# Altium project EMDO601_Patch.PrjPcb
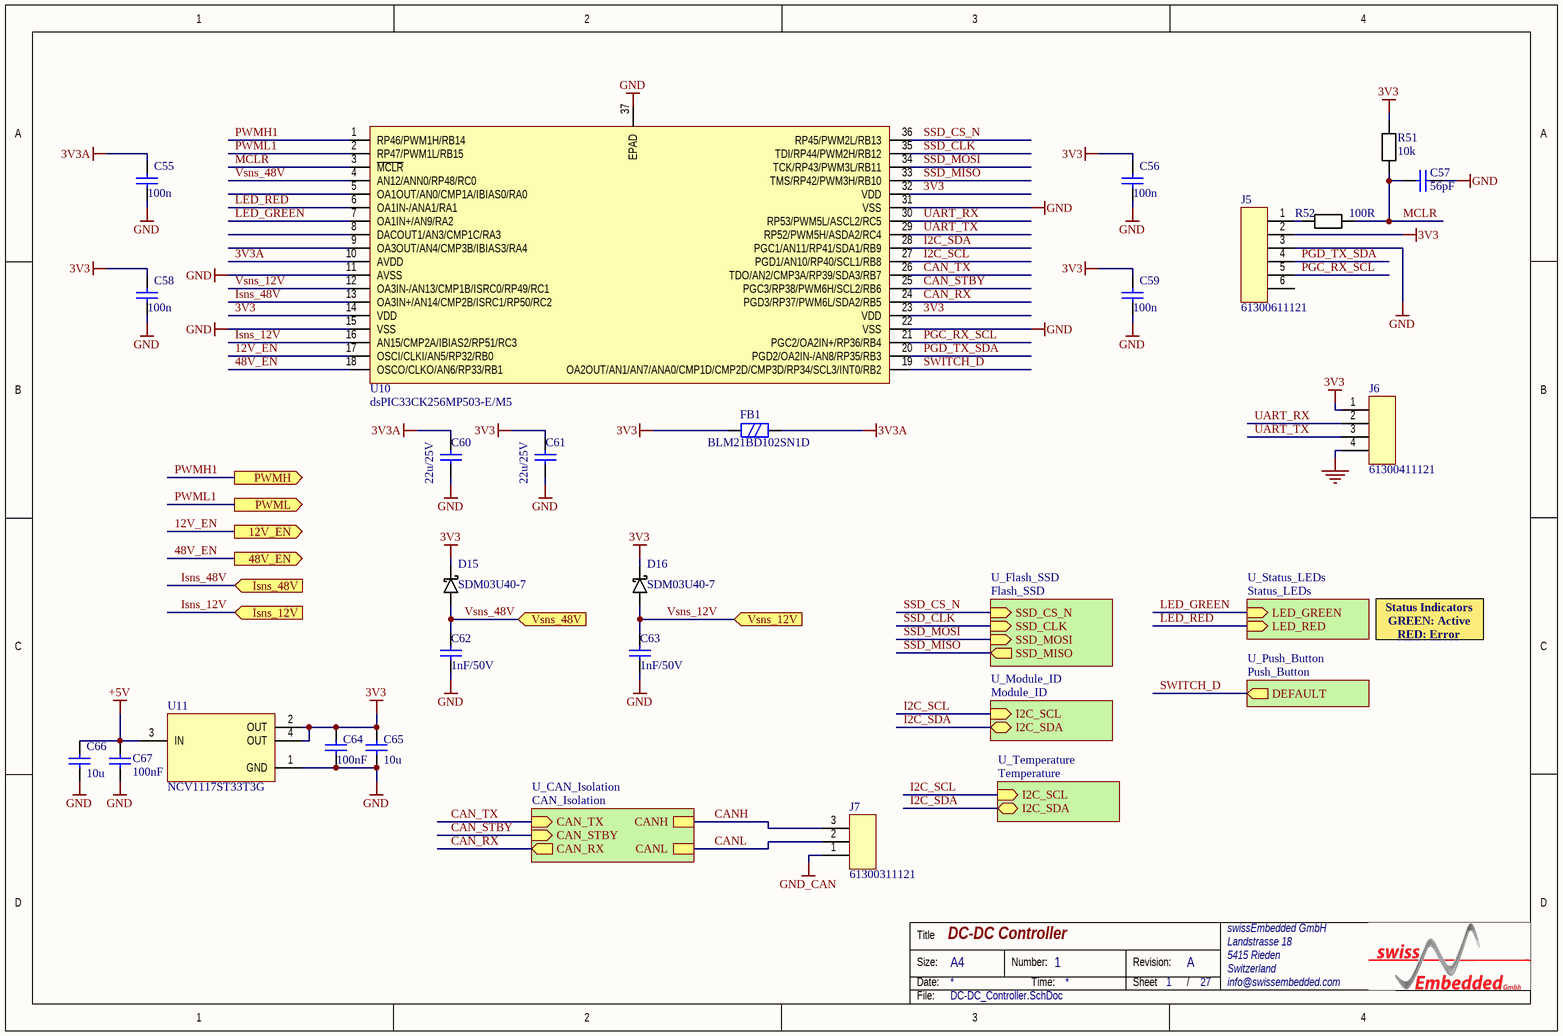
[diagram p0: DC-DC_Controller.SchDoc]
2 sheets, 182 parts. Net scope: hierarchical (ports join the sheet entries above them; power ports are global).
Board file: EMDO601_Patch.PcbDoc
Sheets:
  DC-DC_Controller.SchDoc
  DC-DC_Converter.SchDoc

## Sheet DC-DC_Controller.SchDoc: DC-DC Controller
size A4; CompanyName: swissEmbedded GmbH; Organization: swissEmbedded GmbH; Address1: Landstrasse 18; Address2: 5415 Rieden; Address3: Switzerland; Address4: info@swissembedded.com; DocumentNumber: 1; Revision: A; SheetNumber: 1; SheetTotal: 27

### Parts
C55  100n  [C0603]
C56  100n  [C0603]
C57  56pF  [C0603]
C58  100n  [C0603]
C59  100n  [C0603]
C60  22u/25V  [C0805]
C61  22u/25V  [C0805]
C62  1nF/50V  [C0603]
C63  1nF/50V  [C0603]
C64  100nF  [C0603]
C65  10u  [C1206]
C66  10u  [C1206]
C67  100nF  [C0603]
D15  SDM03U40-7  [SOD523]
D16  SDM03U40-7  [SOD523]
FB1  BLM21BD102SN1D  [R0805]
J5  61300611121  [Header-2.54m-6pin]
J6  61300411121  [Header-2.54m-4pin]
J7  61300311121  [Header-2.54m-3pin]
R51  10k  [R0603]
R52  100R  [R0603]
U10  dsPIC33CK256MP503-E/M5  [UQFN-36]
U11  NCV1117ST33T3G  [SOT223-3]

### Sub-sheets
U_CAN_Isolation = CAN_Isolation (file not in this document): CAN_TX (in), CAN_RX (out), CAN_STBY (in), CANH, CANL
U_Flash_SSD = Flash_SSD (file not in this document): SSD_CS_N (in), SSD_CLK (in), SSD_MOSI (in), SSD_MISO (out)
U_Module_ID = Module_ID (file not in this document): I2C_SCL (in), I2C_SDA (bidir)
U_Push_Button = Push_Button (file not in this document): DEFAULT (out)
U_Status_LEDs = Status_LEDs (file not in this document): LED_RED (in), LED_GREEN (in)
U_Temperature = Temperature (file not in this document): I2C_SCL (in), I2C_SDA (bidir)

### Ports
12V_EN (out), 48V_EN (out), Isns_12V (in), Isns_48V (in), PWMH (out), PWML (out), Vsns_12V (in), Vsns_48V (in)

### Nets
3V3: C56.2 C58.2 C59.2 C61.2 C64.2 C65.2 D15.C D16.C FB1.2 J5.2 J6.1 R51.1 U10.14(VDD) U10.23(VDD) U10.32(VDD) U11.2(OUT) U11.4(OUT)
3V3A: C55.2 C60.2 FB1.1 U10.10(AVDD)
+5V: C66.2 C67.2 U11.3(IN)
GND: C55.1 C56.1 C57.2 C58.1 C59.1 C60.1 C61.1 C62.1 C63.1 C64.1 C65.1 C66.1 C67.1 J5.3 J6.4 U10.11(AVSS) U10.15(VSS) U10.22(VSS) U10.31(VSS) U10.37(EPAD) U11.1(GND)
GND_CAN: J7.1
12V_EN: U10.17(OSCI/CLKI/AN5/RP32/RB0) ; port 12V_EN
48V_EN: U10.18(OSCO/CLKO/AN6/RP33/RB1) ; port 48V_EN
CAN_RX: U10.24(PGD3/RP37/PWM6L/SDA2/RB5) ; sheet U_CAN_Isolation/CAN_RX
CAN_STBY: U10.25(PGC3/RP38/PWM6H/SCL2/RB6) ; sheet U_CAN_Isolation/CAN_STBY
CAN_TX: U10.26(TDO/AN2/CMP3A/RP39/SDA3/RB7) ; sheet U_CAN_Isolation/CAN_TX
CANH: J7.3 ; sheet U_CAN_Isolation/CANH
CANL: J7.2 ; sheet U_CAN_Isolation/CANL
I2C_SCL: U10.27(PGD1/AN10/RP40/SCL1/RB8) ; sheet U_Module_ID/I2C_SCL, sheet U_Temperature/I2C_SCL
I2C_SDA: U10.28(PGC1/AN11/RP41/SDA1/RB9) ; sheet U_Module_ID/I2C_SDA, sheet U_Temperature/I2C_SDA
Isns_12V: U10.16(AN15/CMP2A/IBIAS2/RP51/RC3) ; port Isns_12V
Isns_48V: U10.13(OA3IN+/AN14/CMP2B/ISRC1/RP50/RC2) ; port Isns_48V
LED_GREEN: U10.7(OA1IN+/AN9/RA2) ; sheet U_Status_LEDs/LED_GREEN
LED_RED: U10.6(OA1IN-/ANA1/RA1) ; sheet U_Status_LEDs/LED_RED
MCLR: C57.1 R51.2 R52.2 U10.3(~{MCLR})
PGC_RX_SCL: J5.5 U10.21(PGC2/OA2IN+/RP36/RB4)
PGD_TX_SDA: J5.4 U10.20(PGD2/OA2IN-/AN8/RP35/RB3)
PWMH1: U10.1(RP46/PWM1H/RB14) ; port PWMH
PWML1: U10.2(RP47/PWM1L/RB15) ; port PWML
SSD_CLK: U10.35(TDI/RP44/PWM2H/RB12) ; sheet U_Flash_SSD/SSD_CLK
SSD_CS_N: U10.36(RP45/PWM2L/RB13) ; sheet U_Flash_SSD/SSD_CS_N
SSD_MISO: U10.33(TMS/RP42/PWM3H/RB10) ; sheet U_Flash_SSD/SSD_MISO
SSD_MOSI: U10.34(TCK/RP43/PWM3L/RB11) ; sheet U_Flash_SSD/SSD_MOSI
SWITCH_D: U10.19(OA2OUT/AN1/AN7/ANA0/CMP1D/CMP2D/CMP3D/RP34/SCL3/INT0/RB2) ; sheet U_Push_Button/DEFAULT
UART_RX: J6.2 U10.30(RP53/PWM5L/ASCL2/RC5)
UART_TX: J6.3 U10.29(RP52/PWM5H/ASDA2/RC4)
Vsns_12V: C63.2 D16.A U10.12(OA3IN-/AN13/CMP1B/ISRC0/RP49/RC1) ; port Vsns_12V
Vsns_48V: C62.2 D15.A U10.4(AN12/ANN0/RP48/RC0) ; port Vsns_48V
NetJ5_1: J5.1 R52.1

Not connected (* = marked no-connect by the designer): J5 6; U10 5(OA1OUT/AN0/CMP1A/IBIAS0/RA0) 8(DACOUT1/AN3/CMP1C/RA3) 9(OA3OUT/AN4/CMP3B/IBIAS3/RA4)

### Notes on the sheet
- Status Indicators
  GREEN: Active
  RED: Error
- Title
- Size:
- Date:
- A4
- Number:
- Time:
- Revision:
- Sheet
- /
- File:

### Library data of the parts
C55 C56 C58 C59 = CAP_YAG_CC0603KRX7R9BB104_X7R: 100nF ±10% 50V; Manufacturer: Yageo; Tolerance: +-10%; Type: X7R; Voltage (V): 50; Part Number: CAP_YAG_CC0603KRX7R9BB104_X7R; Manufacturer Part Number: CC0603KRX7R9BB104; Category: Capacitor; Package / Case: 0603; Capacitor (Farad): 100n; Thickness (mm): 0.8; Value: 100n; Price: 0.1; Supplier: mouser; Supplier Part Number: 603-CC0603KRX7R9BB104
C57 = CAP: 330pF ± 5% 50V; Manufacturer: Yageo; Manufacturer Part Number: CC0603JRNPO9BN560; Value: 56pF; Price: 0.1; Supplier: mouser; Supplier Part Number: 603-CC603JRNPO9BN560
C60 C61 = CAP: 22uF ±10% 25V; Manufacturer: Yageo; Manufacturer Part Number: CC0805MKX5R8BB226; Value: 22u/25V; Price: 0.4; Supplier: mouser; Supplier Part Number: 603-CC805MKX5R8BB226
C62 C63 = CAP: 1nF ±10% 50V; Manufacturer: Yageo; Manufacturer Part Number: CC0603KRNPO9BN102; Value: 1nF/50V; Price: 0.1; Supplier: mouser; Supplier Part Number: 603-CC0603KRNPO9BN102
C64 C67 = 100nF ± 10% 50V: Manufacturer: Yageo; Manufacturer Part Number: CC0603KRX7R9BB104; Value: 100nF; Supplier: Mouser; Supplier Part Number: 603-CC603KRX7R9BB104; Price: 0.1
C65 C66 = 10uF ± 10% 25V: Manufacturer: Yageo; Manufacturer Part Number: CC1206KKX7R8BB106; Tolerance: +-10%; Type: X7R; Voltage (V): 25; Category: Capacitor; Value: 10u; Price: 0.44; Supplier: Mouser; Supplier Part Number: 603-CC126KKX7R8BB106
D15 D16 = SDM03U40-7: Schottky Diodes & Rectifiers 40V 150mW; Manufacturer: Diodes Incorporated; Manufacturer Part Number: SDM03U40-7; Value: SDM03U40-7; Supplier: mouser; Supplier Part Number: 621-SDM03U40-F; Price: 0.23
FB1 = SMD_FB: FERRITE BEAD 1 KOHM 0805 1LN; Manufacturer: Murata Electronics; Value: BLM21BD102SN1D; Manufacturer Part Number: BLM21BD102SN1D; Supplier: mouser; Supplier Part Number: 81-BLM21B102S; Price: 0.15
J5 = 6PinConnector: 6 Pins 2.54mm Pitch Male Connector; Manufacturer: Wurth Elektronik; Manufacturer Part Number: 61300611121; Price: 0.33; Supplier: mouser; Supplier Part Number: 710-61300611121; Value: 61300611121
J6 = 61300411121: Headers & Wire Housings WR-PHD 2.54mm Hdr 4P Single Str Gold; Manufacturer: Wurth; Manufacturer Part Number: 61300411121; Price: 0.2; Supplier: Mouser; Supplier Part Number: 710-61300411121; Value: 61300411121
J7 = 61300311121: Headers & Wire Housings WR-PHD 2.54mm Hdr 3P Single Str Gold; Manufacturer: Wurth; Manufacturer Part Number: 61300311121; Price: 0.13; Supplier: Mouser; Supplier Part Number: 710-61300311121; Value: 61300311121
R51 = RES: 0.1W/ 10kohm±1%; Manufacturer Part Number: RC0603FR-0710KL; Manufacturer: Yageo; Value: 10k; Supplier: mouser; Supplier Part Number: 603-RC0603FR-0710KL; Price: 0.1
R52 = RES: 0.1W/ 100 ohm±1%; Manufacturer Part Number: RC0603FR-07100RL; Manufacturer: Yageo; Value: 100R; Supplier: mouser; Supplier Part Number: 603-RC0603FR-07100RL; Price: 0.1
U10 = dsPIC33CK256MP503-E/M5: Digital Signal Processors & Controllers - DSP, DSC 16 Bit DSC, 256KB Flash, 24KB RAM, 100MHz, 28Pin, 3 OpAmp, 3 Comp, PTG, CAN-FD; Manufacturer: Microchip Technology; Alternative Part Number: dsPIC33CK128MP203-I/M5; Manufacturer Part Number: dsPIC33CK256MP503-E/M5; Value: dsPIC33CK256MP503-E/M5; Price: 4; Supplier: Mouser; Supplier Part Number: 579-PIC33CK256MP503E
U11 = NCV1117ST33T3G: LDO Voltage Regulators 3.3V 1.0A Automotive; Manufacturer: onsemi; Price: 0.7; Manufacturer Part Number: NCV1117ST33T3G; Supplier Part Number: 863-NCV1117ST33T3G; Value: NCV1117ST33T3G; Supplier: Mouser

## Sheet DC-DC_Converter.SchDoc: DC-DC_Converter
size A2; DrawnBy: Daniel Haensse; Engineer: Daniel Haensse; Organization: swissEmbedded GmbH; Address1: Landstrasse 18; Address2: 5415 Rieden; Address3: Switzerland; Address4: info@swissembedded.com; Revision: A; SheetNumber: 1; SheetTotal: 1
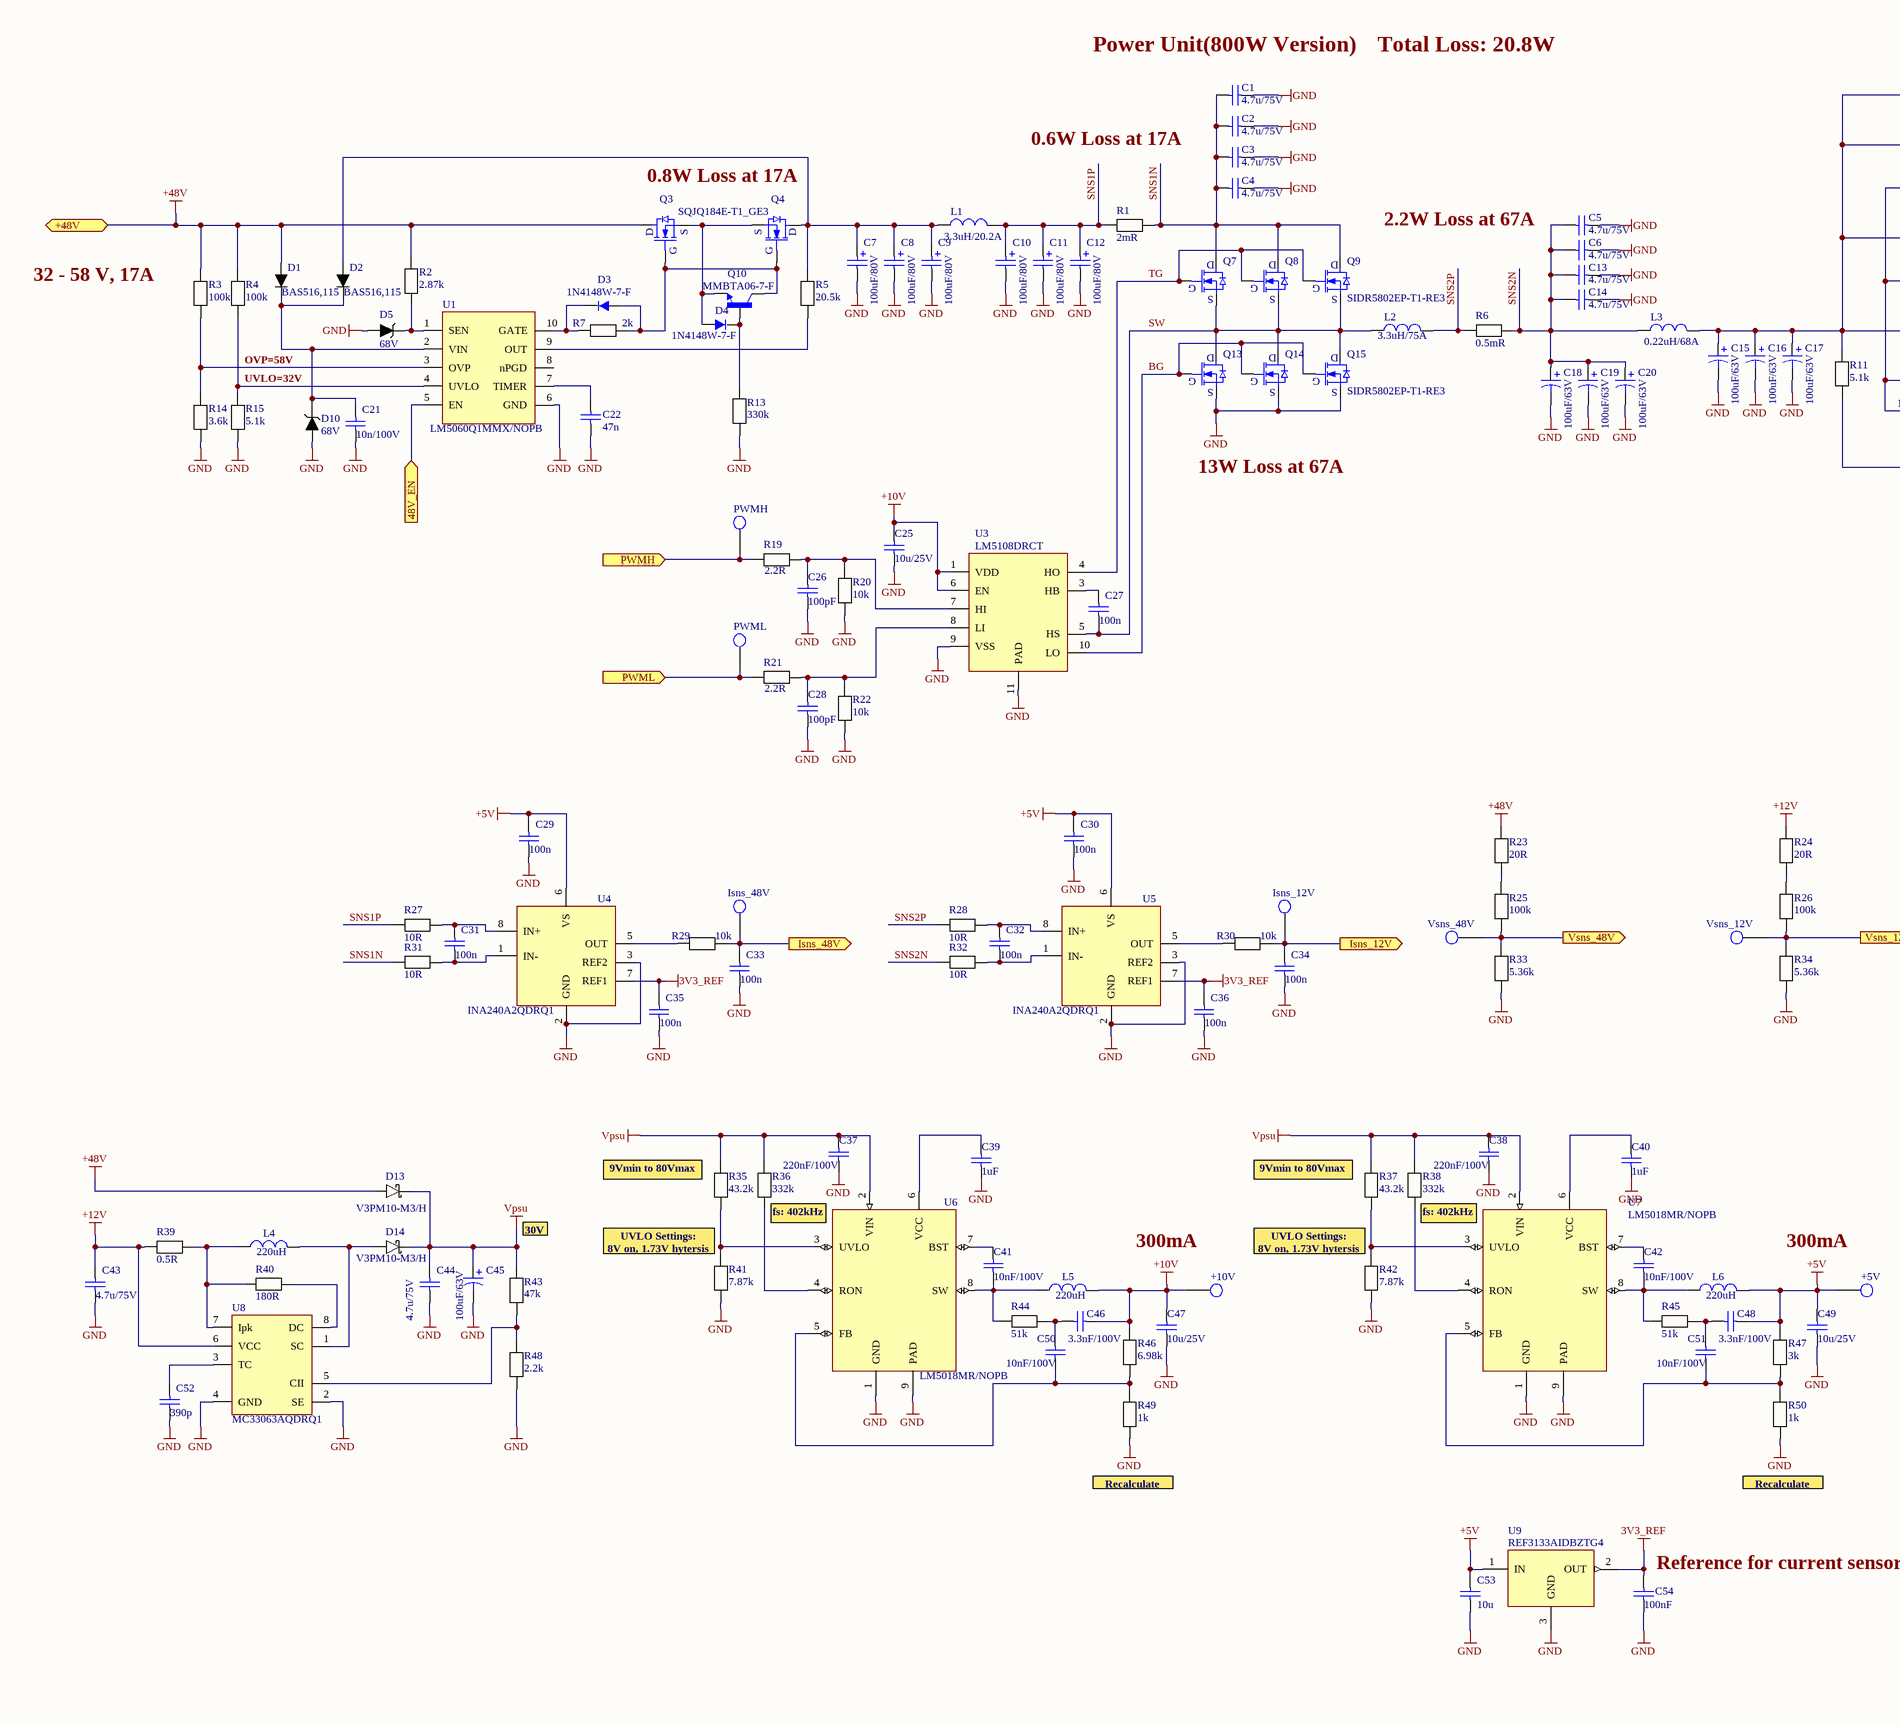
[diagram p1: DC-DC_Converter.SchDoc, left]
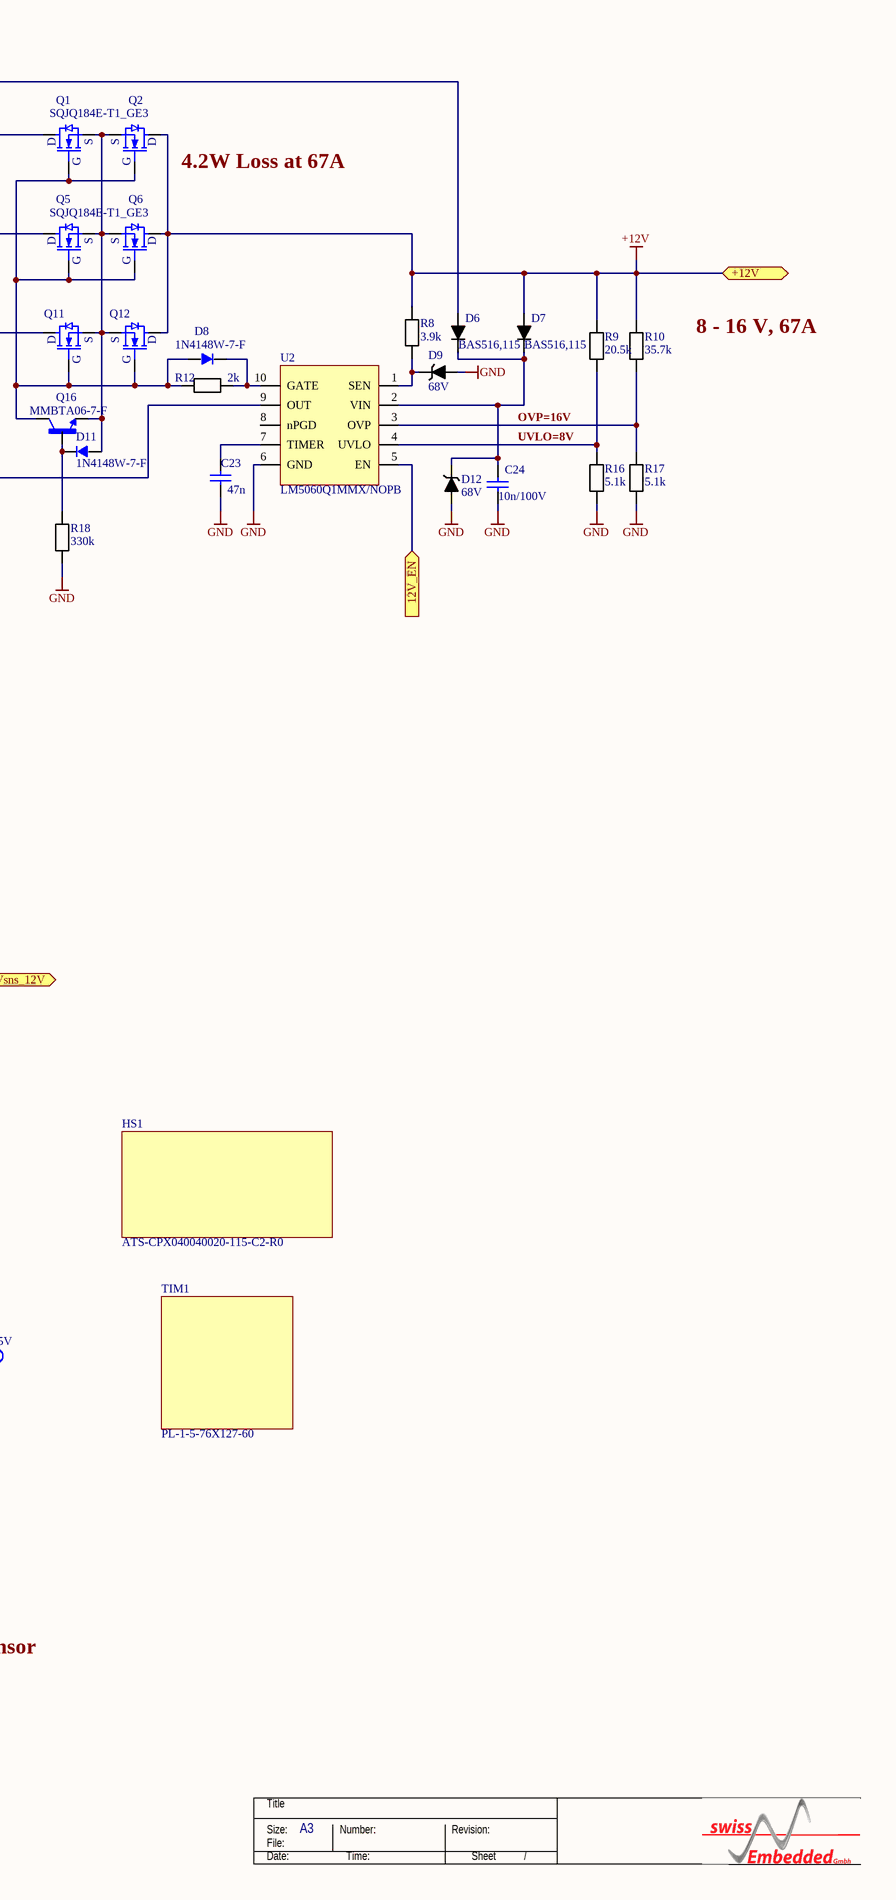
[diagram p2: DC-DC_Converter.SchDoc, right]

### Parts
+5V  NO FIT  [TP_1]  (value not drawn)
+10V  NO FIT  [TP_1]  (value not drawn)
C1  4.7u/75V  [C1210]
C2  4.7u/75V  [C1210]
C3  4.7u/75V  [C1210]
C4  4.7u/75V  [C1210]
C5  4.7u/75V  [C1210]
C6  4.7u/75V  [C1210]
C7  100uF/80V  [CAP_80SXV47M]
C8  100uF/80V  [CAP_80SXV47M]
C9  100uF/80V  [CAP_80SXV47M]
C10  100uF/80V  [CAP_80SXV47M]
C11  100uF/80V  [CAP_80SXV47M]
C12  100uF/80V  [CAP_80SXV47M]
C13  4.7u/75V  [C1210]
C14  4.7u/75V  [C1210]
C15  100uF/63V  [CAP_80SXV47M]
C16  100uF/63V  [CAP_80SXV47M]
C17  100uF/63V  [CAP_80SXV47M]
C18  100uF/63V  [CAP_80SXV47M]
C19  100uF/63V  [CAP_80SXV47M]
C20  100uF/63V  [CAP_80SXV47M]
C21  10n/100V  [C0805]
C22  47n  [C0603]
C23  47n  [C0603]
C24  10n/100V  [C0805]
C25  10u/25V  [C0805]
C26  100pF  [C0603]
C27  100n  [C0603]
C28  100pF  [C0603]
C29  100n  [C0603]
C30  100n  [C0603]
C31  100n  [C0603]
C32  100n  [C0603]
C33  100n  [C0603]
C34  100n  [C0603]
C35  100n  [C0603]
C36  100n  [C0603]
C37  220nF/100V  [C0805]
C38  220nF/100V  [C0805]
C39  1uF  [C0603]
C40  1uF  [C0603]
C41  10nF/100V  [C0603]
C42  10nF/100V  [C0603]
C43  4.7u/75V  [C1210]
C44  4.7u/75V  [C1210]
C45  100uF/63V  [CAP_80SXV47M]
C46  3.3nF/100V  [C0603]
C47  10u/25V  [C0805]
C48  3.3nF/100V  [C0603]
C49  10u/25V  [C0805]
C50  10nF/100V  [C0603]
C51  10nF/100V  [C0603]
C52  390p  [C0603]
C53  10u  [C1206]
C54  100nF  [C0603]
D1  BAS516,115  [SOD523]
D2  BAS516,115  [SOD523]
D3  1N4148W-7-F  [SOD-123]
D4  1N4148W-7-F  [SOD-123]
D5  68V  [SOT23-3]
D6  BAS516,115  [SOD523]
D7  BAS516,115  [SOD523]
D8  1N4148W-7-F  [SOD-123]
D9  68V  [SOT23-3]
D10  68V  [SOT23-3]
D11  1N4148W-7-F  [SOD-123]
D12  68V  [SOT23-3]
D13  V3PM10-M3/H  [DO-220AA]
D14  V3PM10-M3/H  [DO-220AA]
HS1  ATS-CPX040040020-115-C2-R0  [HeatSink_ATS-CPX040040020-115-C2-R0]  (no BOM)
Isns_12V  NO FIT  [TP_1]  (value not drawn)
Isns_48V  NO FIT  [TP_1]  (value not drawn)
L1  3.3uH/20.2A  [IND_IHLP5050FDER3R3M5A]
L2  3.3uH/75A  [IND_7443763521033]
L3  0.22uH/68A  [IND_IHLP5050EZERR22M5A]
L4  220uH  [IND_SRN6045]
L5  220uH  [IND_SRN6045]
L6  220uH  [IND_SRN6045]
PWMH  NO FIT  [TP_1]  (value not drawn)
PWML  NO FIT  [TP_1]  (value not drawn)
Q1  SQJQ184E-T1_GE3  [PowerPAK8x8L]
Q2  SQJQ184E-T1_GE3  [PowerPAK8x8L]  (value not drawn)
Q3  SQJQ184E-T1_GE3  [PowerPAK8x8L]
Q4  SQJQ184E-T1_GE3  [PowerPAK8x8L]  (value not drawn)
Q5  SQJQ184E-T1_GE3  [PowerPAK8x8L]
Q6  SQJQ184E-T1_GE3  [PowerPAK8x8L]  (value not drawn)
Q7  SIDR5802EP-T1-RE3  [PowerPAK SO-8DC]
Q8  SIDR5802EP-T1-RE3  [PowerPAK SO-8DC]  (value not drawn)
Q9  SIDR5802EP-T1-RE3  [PowerPAK SO-8DC]  (value not drawn)
Q10  MMBTA06-7-F  [SOT23-3]
Q11  SQJQ184E-T1_GE3  [PowerPAK8x8L]  (value not drawn)
Q12  SQJQ184E-T1_GE3  [PowerPAK8x8L]  (value not drawn)
Q13  SIDR5802EP-T1-RE3  [PowerPAK SO-8DC]
Q14  SIDR5802EP-T1-RE3  [PowerPAK SO-8DC]  (value not drawn)
Q15  SIDR5802EP-T1-RE3  [PowerPAK SO-8DC]  (value not drawn)
Q16  MMBTA06-7-F  [SOT23-3]
R1  2mR  [R3921]
R2  2.87k  [R0603]
R3  100k  [R0603]
R4  100k  [R0603]
R5  20.5k  [R0603]
R6  0.5mR  [R3921]
R7  2k  [R0603]
R8  3.9k  [R0603]
R9  20.5k  [R0603]
R10  35.7k  [R0603]
R11  5.1k  [R0603]
R12  2k  [R0603]
R13  330k  [R0603]
R14  3.6k  [R0603]
R15  5.1k  [R0603]
R16  5.1k  [R0603]
R17  5.1k  [R0603]
R18  330k  [R0603]
R19  2.2R  [R0603]
R20  10k  [R0603]
R21  2.2R  [R0603]
R22  10k  [R0603]
R23  20R  [R0603]
R24  20R  [R0603]
R25  100k  [R0603]
R26  100k  [R0603]
R27  10R  [R0603]
R28  10R  [R0603]
R29  10k  [R0603]
R30  10k  [R0603]
R31  10R  [R0603]
R32  10R  [R0603]
R33  5.36k  [R0603]
R34  5.36k  [R0603]
R35  43.2k  [R0603]
R36  332k  [R0603]
R37  43.2k  [R0603]
R38  332k  [R0603]
R39  0.5R  [R1206]
R40  180R  [R0603]
R41  7.87k  [R0603]
R42  7.87k  [R0603]
R43  47k  [R0603]
R44  51k  [R0603]
R45  51k  [R0603]
R46  6.98k  [R0603]
R47  3k  [R0603]
R48  2.2k  [R0603]
R49  1k  [R0603]
R50  1k  [R0603]
TIM1  PL-1-5-76X127-60  (no BOM)
U1  LM5060Q1MMX/NOPB  [MSOP-10]
U2  LM5060Q1MMX/NOPB  [MSOP-10]
U3  LM5108DRCT  [VSON-10]
U4  INA240A2QDRQ1  [SOIC-8]
U5  INA240A2QDRQ1  [SOIC-8]
U6  LM5018MR/NOPB  [SOIC-8(EPAD)]
U7  LM5018MR/NOPB  [SOIC-8(EPAD)]
U8  MC33063AQDRQ1  [SOIC-8]
U9  REF3133AIDBZTG4  [SOT23-3]
Vsns_12V  NO FIT  [TP_1]  (value not drawn)
Vsns_48V  NO FIT  [TP_1]  (value not drawn)

### Ports
12V_EN (in), 48V_EN (in), +12V, +48V, Isns_12V (out), Isns_48V (out), PWMH (in), PWML (in), Vsns_12V (out), Vsns_48V (out)

### Nets
3V3_REF: C35.2 C36.2 C54.2 U4.7(REF1) U5.7(REF1) U9.2(OUT)
+5V: +5V.1(TCT) C29.2 C30.2 C48.1 C49.2 C53.2 L6.2 R47.2 U4.6(VS) U5.6(VS) U9.1(IN)
+10V: +10V.1(TCT) C25.2 C46.1 C47.2 L5.2 R46.2 U3.1(VDD) U3.6(EN)
+12V: C43.2 D7.A Q2.D Q6.D Q12.D R8.2 R9.2 R10.2 R24.1 R39.1 U8.6(VCC) ; port +12V
+48V: D1.A D13.A Q3.D R2.2 R3.2 R4.2 R23.1 ; port +48V
GND: C1.2 C2.2 C3.2 C4.2 C5.2 C6.2 C7.2 C8.2 C9.2 C10.2 C11.2 C12.2 C13.2 C14.2 C15.2 C16.2 C17.2 C18.2 C19.2 C20.2 C21.1 C22.1 C23.1 C24.1 C25.1 C26.2 C28.2 C29.1 C30.1 C33.1 C34.1 C35.1 C36.1 C37.1 C38.1 C39.1 C40.1 C43.1 C44.1 C45.2 C47.1 C49.1 C52.1 C53.1 C54.1 D5.1(A) D9.1(A) D10.1(A) D12.1(A) Q13.S Q14.S Q15.S R13.1 R14.1 R15.1 R16.1 R17.1 R18.1 R20.1 R22.1 R33.2 R34.2 R41.2 R42.2 R48.1 R49.2 R50.2 U1.6(GND) U2.6(GND) U3.9(VSS) U3.11(PAD) U4.2(GND) U4.3(REF2) U5.2(GND) U5.3(REF2) U6.1(GND) U6.9(PAD) U7.1(GND) U7.9(PAD) U8.2(SE) U8.4(GND) U9.3(GND)
Vpsu: C37.2 C38.2 C44.2 C45.1 D13.C D14.C R35.1 R36.1 R37.1 R38.1 R43.2 U6.2(VIN) U7.2(VIN)
BG: Q13.G Q14.G Q15.G U3.10(LO)
SNS1N: C1.1 C2.1 C3.1 C4.1 Q7.D Q8.D Q9.D R1.2 R31.1
SNS1P: C10.1 C11.1 C12.1 L1.2 R1.1 R27.1
SNS2N: C5.1 C6.1 C13.1 C14.1 C18.1 C19.1 C20.1 L3.1 R6.2 R32.1
SNS2P: L2.2 R6.1 R28.1
SW: C27.1 L2.1 Q7.S Q8.S Q9.S Q13.D Q14.D Q15.D U3.5(HS)
TG: Q7.G Q8.G Q9.G U3.4(HO)
NetC7_1: C7.1 C8.1 C9.1 D2.A L1.1 Q4.D R5.2
NetC15_1: C15.1 C16.1 C17.1 D6.A L3.2 Q1.D Q5.D Q11.D R11.2
NetC21_2: C21.2 D1.C D2.C D10.3(C) U1.2(VIN)
NetC22_2: C22.2 U1.7(TIMER)
NetC23_2: C23.2 U2.7(TIMER)
NetC24_2: C24.2 D6.C D7.C D12.3(C) U2.2(VIN)
NetC26_1: C26.1 R19.2 R20.2 U3.7(HI)
NetC27_2: C27.2 U3.3(HB)
NetC28_1: C28.1 R21.2 R22.2 U3.8(LI)
NetC31_1: C31.1 R31.2 U4.1(IN-)
NetC31_2: C31.2 R27.2 U4.8(IN+)
NetC32_1: C32.1 R32.2 U5.1(IN-)
NetC32_2: C32.2 R28.2 U5.8(IN+)
NetC33_2: C33.2 Isns_48V.1(TCT) R29.2 ; port Isns_48V
NetC34_2: C34.2 Isns_12V.1(TCT) R30.2 ; port Isns_12V
NetC39_2: C39.2 U6.6(VCC)
NetC40_2: C40.2 U7.6(VCC)
NetC41_1: C41.1 L5.1 R44.1 U6.8(SW)
NetC41_2: C41.2 U6.7(BST)
NetC42_1: C42.1 L6.1 R45.1 U7.8(SW)
NetC42_2: C42.2 U7.7(BST)
NetC46_2: C46.2 C50.2 R44.2
NetC48_2: C48.2 C51.2 R45.2
NetC50_1: C50.1 R46.1 R49.1 U6.5(FB)
NetC51_1: C51.1 R47.1 R50.1 U7.5(FB)
NetC52_2: C52.2 U8.3(TC)
NetD3_A: D3.A Q3.G Q4.G Q10.3(C) R7.2
NetD3_C: D3.C(K) R7.1 U1.10(GATE)
NetD4_A: D4.A Q3.S Q4.S Q10.2(E)
NetD4_C: D4.C(K) Q10.1(B) R13.2
NetD5_3: D5.3(C) R2.1 U1.1(SEN)
NetD8_A: D8.A Q1.G Q2.G Q5.G Q6.G Q11.G Q12.G Q16.3(C) R12.1
NetD8_C: D8.C(K) R12.2 U2.10(GATE)
NetD9_3: D9.3(C) R8.1 U2.1(SEN)
NetD11_A: D11.A Q1.S Q2.S Q5.S Q6.S Q11.S Q12.S Q16.2(E)
NetD11_C: D11.C(K) Q16.1(B) R18.2
NetD14_A: D14.A L4.2 U8.1(SC)
NetL4_1: L4.1 R39.2 R40.1 U8.7(Ipk)
NetPWMH_1: PWMH.1(TCT) R19.1 ; port PWMH
NetPWML_1: PWML.1(TCT) R21.1 ; port PWML
NetR3_1: R3.1 R14.2 U1.3(OVP)
NetR4_1: R4.1 R15.2 U1.4(UVLO)
NetR5_1: R5.1 U1.9(OUT)
NetR9_1: R9.1 R16.2 U2.4(UVLO)
NetR10_1: R10.1 R17.2 U2.3(OVP)
NetR11_1: R11.1 U2.9(OUT)
NetR23_2: R23.2 R25.2
NetR24_2: R24.2 R26.2
NetR25_1: R25.1 R33.1 Vsns_48V.1(TCT) ; port Vsns_48V
NetR26_1: R26.1 R34.1 Vsns_12V.1(TCT) ; port Vsns_12V
NetR29_1: R29.1 U4.5(OUT)
NetR30_1: R30.1 U5.5(OUT)
NetR35_2: R35.2 R41.1 U6.3(UVLO)
NetR36_2: R36.2 U6.4(RON)
NetR37_2: R37.2 R42.1 U7.3(UVLO)
NetR38_2: R38.2 U7.4(RON)
NetR40_2: R40.2 U8.8(DC)
NetR43_1: R43.1 R48.2 U8.5(CII)
NetU1_5: U1.5(EN) ; port 48V_EN
NetU2_5: U2.5(EN) ; port 12V_EN

Not connected (* = marked no-connect by the designer): U1 8(nPGD); U2 8(nPGD)

### Notes on the sheet
- (near C1) Power Unit(800W Version)
- Total Loss: 20.8W
- 0.6W Loss at 17A
- 0.8W Loss at 17A
- (near Q2) 4.2W Loss at 67A
- 2.2W Loss at 67A
- (near R3) 32 - 58 V, 17A
- 8 - 16 V, 67A
- OVP=58V
- (near R15) UVLO=32V
- OVP=16V
- UVLO=8V
- 13W Loss at 67A
- (near R35) 9Vmin to 80Vmax
- (near R37) 9Vmin to 80Vmax
- 30V
- (near R41) UVLO Settings:
  8V on, 1.73V hytersis
- fs: 402kHz
- 300mA
- (near R42) UVLO Settings:
  8V on, 1.73V hytersis
- Recalculate
- (near C54) Reference for current sensor
- Title
- Size:
- Date:
- File:
- A3
- Number:
- Time:
- Revision:
- Sheet
- /

### Library data of the parts
+5V +10V Isns_12V Isns_48V PWMH PWML Vsns_12V Vsns_48V = TP: Testpoint; Manufacturer: None; Manufacturer Part Number: Testpads, do not populate; Value: TP
C1-C6 C13 C14 C43 C44 = C3225X7R1N106K250AC: 4.7uF ±10% 75V; Manufacturer: TDK; Value: 4.7u/75V; Manufacturer Part Number: C3225X7R1N106K250AC; Supplier: mouser; Supplier Part Number: 810-C3225X7R1N106K25; Price: 0.9
C7-C12 = 100uF ±20% 80V: Manufacturer Part Number: MAL215099702E3; Manufacturer: Vishay / BC Components; Supplier: Mouser; Supplier Part Number: 594-MAL215099702E3; Value: 100uF/80V; Price: 2.4
C15-C20 C45 = Cap Pol1: 100uF ±20% 63V; Manufacturer Part Number: A771MS107M1JLAS018; Manufacturer: KEMET; Supplier: mouser; Supplier Part Number: 80-A771MS107M1JLAS18; Value: 100uF/63V; Price: 1.26
C21 C24 = 10nF ±10% 100V: Manufacturer: Yageo; Manufacturer Part Number: CC0805KPX7R0BB103; Capacitor (Farad): 10n; Tolerance: +-10%; Type: X7R; Voltage (V): 100; Category: Capacitor; Package / Case: 0603; Thickness (mm): 0.8; Value: 10n/100V; Price: 0.1; Supplier: mouser; Supplier Part Number: 603-CC0805KPX7R0BB103
C22 C23 = 47nF ±10% 50V: Manufacturer: Yageo; Manufacturer Part Number: CC0603KRX7R9BB473; Tolerance: +-10%; Type: X7R; Voltage (V): 50; Category: Capacitor; Package / Case: 0603; Capacitor (Farad): 47n; Thickness (mm): 0.8; Value: 47n; Price: 0.1; Supplier: mouser; Supplier Part Number: 603-CC0603KRX7R9BB473
C25 C47 C49 = CAP: 10uF ±10% 25V; Manufacturer: Yageo; Manufacturer Part Number: CC0805KKX5R8BB106; Value: 10u/25V; Price: 0.3; Supplier: mouser; Supplier Part Number: 603-CC0805KKX5R8BB106
C26 C28 = CAP: 100pF ±10% 50V; Manufacturer: Yageo; Manufacturer Part Number: CC0603KRNPO9BN101; Value: 100pF; Price: 0.1; Supplier: mouser; Supplier Part Number: 603-CC0603KRNPO9BN101
C27 C29-C36 = CAP_YAG_CC0603KRX7R9BB104_X7R: as C55 on sheet DC-DC_Controller; Part Number: CAP_YAG_CC0603KRX7R9BB104_X7R; Manufacturer Part Number: CC0603KRX7R9BB104; Category: Capacitor; Package / Case: 0603; Capacitor (Farad): 100n; Thickness (mm): 0.8; Value: 100n; Price: 0.1; Supplier: mouser; Supplier Part Number: 603-CC0603KRX7R9BB104
C37 C38 = CAP: 220nF ±10% 100V; Manufacturer: Yageo; Manufacturer Part Number: CC0805KKX7R0BB224; Value: 220nF/100V; Supplier: mouser; Supplier Part Number: 603-CC805KKX7R0BB224; Price: 0.26
C39 C40 = CAP: 1uF ±10% 50V; Manufacturer: Yageo; Manufacturer Part Number: CC0603KRX7R9BB105; Value: 1uF; Price: 0.4; Supplier: mouser; Supplier Part Number: 603-CC603KRX7R9BB105
C41 C42 C50 C51 = CAP: 10nF ±10% 100V; Manufacturer: Yageo; Manufacturer Part Number: CC0603KRX7R0BB103; Value: 10nF/100V; Price: 0.1; Supplier: mouser; Supplier Part Number: 603-CC603KRX7R0BB103
C46 C48 = CAP: 3.3nF ±10% 100V; Manufacturer: Yageo; Manufacturer Part Number: CC0603KRX7R0BB332; Value: 3.3nF/100V; Price: 0.1; Supplier: mouser; Supplier Part Number: 603-CC603KRX7R0BB332
C52 = 390pF ±10% 50V: Manufacturer: Yageo; Manufacturer Part Number: C0603JRNPO9BN391; Tolerance: +-5%; Voltage (V): 50; Category: Capacitor; Package / Case: 0603; Capacitor (Farad): 390p; Thickness (mm): 0.8; Value: 390p; Price: 0.1; Supplier: mouser; Supplier Part Number: 603-C0603JRNPO9BN391
C53 = 10uF ± 10% 25V: as C65 on sheet DC-DC_Controller; Category: Capacitor; Value: 10u; Price: 0.44; Supplier: Mouser; Supplier Part Number: 603-CC126KKX7R8BB106
C54 = 100nF ± 10% 50V: as C64 on sheet DC-DC_Controller; Value: 100nF; Supplier: Mouser; Supplier Part Number: 603-CC603KRX7R9BB104; Price: 0.1
D1 D2 D6 D7 = BAS516,115: Diodes - General Purpose, Power, Switching BAS516/SOD523/SC-79; Manufacturer: Nexperia; Manufacturer Part Number: BAS516,115; Value: BAS516,115; Supplier: mouser; Supplier Part Number: 771-BAS516-T/R; Price: 0.2
D3 D4 D8 D11 = 1N4148W-7-F: Diode Standard 100 V 300mA (DC) Surface Mount SOD-123; Manufacturer: Diodes; Value: 1N4148W-7-F; Supplier: mouser; Supplier Part Number: 621-1N4148W-F; Price: 0.2; Manufacturer Part Number: 1N4148W-7-F
D5 D9 D10 D12 = BZX8450-C68R: Zener Diodes BZX8450-C68/SOT23/TO-236AB; Manufacturer: Nexperia; Manufacturer Part Number: BZX8450-C68R; Value: 68V; Supplier: mouser; Supplier Part Number: 771-BZX8450-C68R; Price: 0.2
D13 D14 = V3PM10-M3/H: Schottky Diodes & Rectifiers 100V 3A TMBS SMP; Manufacturer: Vishay; Manufacturer Part Number: V3PM10-M3/H; Value: V3PM10-M3/H; Supplier: mouser; Supplier Part Number: 78-V3PM10-M3/H; Price: 0.4
HS1 = ATS-CPX040040020-115-C2-R0: Heat Sinks pushPIN Heat Sink, Blue-Anodized, 40x40x20mm; Manufacturer: Advanced Thermal Solutions; Value: ATS-CPX040040020-115-C2-R0; Manufacturer Part Number: ATS-CPX040040020-115-C2-R0; Price: 3.6; Supplier: mouser; Supplier Part Number: 984-CPX04004-115C2R0
L1 = IHLP5050FDER3R3M5A: Power Inductors - SMD 3.3uH 20% High Temp AEC-Q200; Manufacturer: Vishay; Manufacturer Part Number: IHLP5050FDER3R3M5A; Value: 3.3uH/20.2A; Supplier: mouser; Supplier Part Number: 70-IHLP5050FDR3R3M5A; Price: 2.12
L2 = 7443763521033: Power Inductors - Leaded WE-HCFT 3521 3.3uH 20% 75A 0.4mOh; Manufacturer: Wurth Elektronik; Manufacturer Part Number: 7443763521033; Value: 3.3uH/75A; Supplier: mouser; Supplier Part Number: 710-7443763521033; Price: 12
L3 = IHLP5050EZERR22M5A: Power Inductors - SMD 0.22uH 20% High Temp AEC-Q200; Manufacturer: Vishay; Manufacturer Part Number: IHLP5050EZERR22M5A; Value: 0.22uH/68A; Supplier: mouser; Supplier Part Number: 70-IHLP5050EZRR22M5A; Price: 2.4
L4-L6 = Inductor: Power Inductors - SMD 220uH 20% SMD 6045; Manufacturer Part Number: SRN6045-221M; Manufacturer: Bourns; Value: 220uH; Supplier: mouser; Supplier Part Number: 652-SRN6045-221M; Price: 0.5
Q1-Q6 Q11 Q12 = SQJQ184E-T1_GE3: MOSFET N-Ch 80V 430A; Manufacturer: Vishay Semiconductors; Manufacturer Part Number: SQJQ184E-T1_GE3; Value: SQJQ184E-T1_GE3; Supplier: mouser; Supplier Part Number: 78-SQJQ184E-T1_GE3; Price: 3.4
Q7-Q9 Q13-Q15 = SIDR5802EP-T1-RE3: MOSFET N-Ch 80V 153A, 28nC; Manufacturer: Vishay Semiconductors; Manufacturer Part Number: SIDR5802EP-T1-RE3; Value: SIDR5802EP-T1-RE3; Supplier: mouser; Supplier Part Number: 78-SIDR5802EP-T1-RE3; Price: 3
Q10 Q16 = MMBTA06-7-F: Bipolar Transistors - BJT 80V 300mW; Manufacturer: Diodes Incorporated; Price: 0.22; Supplier: mouser; Manufacturer Part Number: MMBTA06-7-F; Value: MMBTA06-7-F; Supplier Part Number: 621-MMBTA06-F
R1 = WSLP39212L000FEA: 5W/ 2mohm±1%; Manufacturer: Vishay / Dale; Manufacturer Part Number: WSLP39212L000FEA; Value: 2mR; Supplier: mouser; Supplier Part Number: 71-WSLP39212L000FEA; Price: 1.8
R2 = 2.87 kohm ±1% 0.1W: Manufacturer Part Number: RC0603FR-072K87L; Manufacturer: Yageo; Tolerance: +-1%; Temperature Coefficient: +-200ppm°C; Power (Watts): 0.1; Voltage (V): 75; Supplier Part Number: 603-RC0603FR-072K87L; Category: Resistor; Package / Case: 0603; Resistor (Ohms): 2.87k; Operating Temperature: -55°C to +155°C; Thickness (mm): 0.45; Supplier: mouser; Price: 0.1; Value: 2.87k
R3 R4 R25 R26 = 100 kohm ±1% 0.1W: Manufacturer Part Number: RC0603FR-07100KL; Manufacturer: Yageo; Tolerance: +-1%; Temperature Coefficient: +-200ppm°C; Power (Watts): 0.1; Voltage (V): 75; Supplier Part Number: 603-RC0603FR-07100KL; Category: Resistor; Package / Case: 0603; Resistor (Ohms): 100k; Operating Temperature: -55°C to +155°C; Thickness (mm): 0.45; Price: 0.1; Value: 100k; Supplier: mouser
R5 = 20.5 kohm ±1% 0.1W: Manufacturer Part Number: RC0603FR-0720K5L; Manufacturer: Yageo; Tolerance: +-1%; Temperature Coefficient: +-200ppm°C; Power (Watts): 0.1; Voltage (V): 75; Supplier Part Number: 603-RC0603FR-0720K5L; Category: Resistor; Package / Case: 0603; Resistor (Ohms): 20.5k; Operating Temperature: -55°C to +155°C; Thickness (mm): 0.45; Supplier: mouser; Price: 0.1; Value: 20.5k
R6 = WSLP3921L5000FEB: 9W/ 0.5mohm±1%; Manufacturer: Vishay / Dale; Manufacturer Part Number: WSLP3921L5000FEB; Value: 0.5mR; Supplier: mouser; Supplier Part Number: 71-WSLP3921L5000FEB; Price: 2
R7 R12 = 2 kohm ±1% 0.1W: Manufacturer Part Number: RC0603FR-072KL; Manufacturer: Yageo; Tolerance: +-1%; Temperature Coefficient: +-200ppm°C; Power (Watts): 0.1; Voltage (V): 75; Supplier Part Number: 603-RC0603FR-072KL; Category: Resistor; Package / Case: 0603; Resistor (Ohms): 2k; Operating Temperature: -55°C to +155°C; Thickness (mm): 0.45; Supplier: mouser; Price: 0.1; Value: 2k
R8 = 3.9 kohm ±1% 0.1W: Manufacturer Part Number: RC0603FR-073K9L; Manufacturer: Yageo; Tolerance: +-1%; Temperature Coefficient: +-200ppm°C; Power (Watts): 0.1; Voltage (V): 75; Supplier Part Number: 603-RC0603FR-073K9L; Category: Resistor; Package / Case: 0603; Resistor (Ohms): 3.9k; Operating Temperature: -55°C to +155°C; Thickness (mm): 0.45; Price: 0.1; Value: 3.9k; Supplier: mouser
R9 = 20.5 kohm ±1% 0.1W: Manufacturer Part Number: RC0603FR-0720K5L; Manufacturer: Yageo; Tolerance: +-1%; Temperature Coefficient: +-200ppm°C; Power (Watts): 0.1; Voltage (V): 75; Suppier: mouser; Supplier Part Number: 603-RC0603FR-0720K5L; Category: Resistor; Package / Case: 0603; Resistor (Ohms): 20.5k; Operating Temperature: -55°C to +155°C; Thickness (mm): 0.45; Price: 0.1; Value: 20.5k
R10 = 35.7kohm ±1% 0.1W: Manufacturer Part Number: RC0603FR-0735K7L; Manufacturer: Yageo; Tolerance: +-1%; Temperature Coefficient: +-200ppm°C; Power (Watts): 0.1; Voltage (V): 75; Supplier Part Number: 603-RC0603FR-0735K7L; Category: Resistor; Package / Case: 0603; Resistor (Ohms): 35.7k; Operating Temperature: -55°C to +155°C; Thickness (mm): 0.45; Price: 0.1; Value: 35.7k; Supplier: mouser
R11 R15-R17 = 5.1kohm ±1% 0.1W: Manufacturer Part Number: RC0603FR-075K1L; Manufacturer: Yageo; Tolerance: +-1%; Temperature Coefficient: +-200ppm°C; Power (Watts): 0.1; Voltage (V): 75; Supplier Part Number: 603-RC0603FR-075K1L; Category: Resistor; Package / Case: 0603; Resistor (Ohms): 5.1k; Operating Temperature: -55°C to +155°C; Thickness (mm): 0.45; Price: 0.1; Value: 5.1k; Supplier: mouser
R13 R18 = 330 kohm ±1% 0.1W: Manufacturer Part Number: RC0603FR-07330KL; Manufacturer: Yageo; Tolerance: +-1%; Temperature Coefficient: +-200ppm°C; Power (Watts): 0.1; Voltage (V): 75; Supplier Part Number: 603-RC0603FR-07330KL; Category: Resistor; Package / Case: 0603; Resistor (Ohms): 330k; Operating Temperature: -55°C to +155°C; Thickness (mm): 0.45; Supplier: mouser; Price: 0.1; Value: 330k
R14 = 3.6kohm ±1% 0.1W: Manufacturer Part Number: RC0603FR-073K6L; Manufacturer: Yageo; Tolerance: +-1%; Temperature Coefficient: +-200ppm°C; Power (Watts): 0.1; Voltage (V): 75; Supplier Part Number: 603-RC0603FR-073K6L; Category: Resistor; Package / Case: 0603; Resistor (Ohms): 3.6k; Operating Temperature: -55°C to +155°C; Thickness (mm): 0.45; Price: 0.1; Value: 3.6k; Supplier: mouser
R19 R21 = RES: 0.1W/ 2.2 ohm±1%; Manufacturer Part Number: RC0603FR-072R2L; Manufacturer: Yageo; Value: 2.2R; Supplier: mouser; Supplier Part Number: 603-RC0603FR-072R2L; Price: 0.1
R20 R22 = RES: as R51 on sheet DC-DC_Controller; Value: 10k; Supplier: mouser; Supplier Part Number: 603-RC0603FR-0710KL; Price: 0.1
R23 R24 = RES: 0.1W/ 20 ohm±1%; Manufacturer Part Number: RC0603FR-0720RL; Manufacturer: Yageo; Value: 20R; Supplier: mouser; Supplier Part Number: 603-RC0603FR-0720RL; Price: 0.1
R27 R28 R31 R32 = 10 ohm ±1% 0.1W: Manufacturer Part Number: RC0603FR-0710RL; Manufacturer: Yageo; Tolerance: +-1%; Temperature Coefficient: +-200ppm°C; Power (Watts): 0.1; Voltage (V): 75; Supplier Part Number: 603-RC0603FR-0710RL; Category: Resistor; Package / Case: 0603; Resistor (Ohms): 10R; Operating Temperature: -55°C to +155°C; Thickness (mm): 0.45; Supplier: mouser; Price: 0.1; Value: 10R
R29 R30 = 10 kohm ±1% 0.1W: Manufacturer Part Number: RC0603FR-0710KL; Manufacturer: Yageo; Tolerance: +-1%; Temperature Coefficient: +-200ppm°C; Power (Watts): 0.1; Voltage (V): 75; Suppier: mouser; Supplier Part Number: 603-RC0603FR-0710KL; Category: Resistor; Package / Case: 0603; Resistor (Ohms): 10k; Operating Temperature: -55°C to +155°C; Thickness (mm): 0.45; Price: 0.1; Value: 10k
R33 R34 = RES: 0.1W/ 5.36kohm±1%; Manufacturer Part Number: RC0603FR-075K36L; Manufacturer: Yageo; Value: 5.36k; Supplier: mouser; Supplier Part Number: 603-RC0603FR-075K36L; Price: 0.1
R35 R37 = RES: 0.1W/ 43.2kohm±1%; Manufacturer Part Number: RC0603FR-0743K2L; Manufacturer: Yageo; Value: 43.2k; Supplier: mouser; Supplier Part Number: 603-RC0603FR-0743K2L; Price: 0.1
R36 R38 = RES: 0.1W/ 332kohm±1%; Manufacturer Part Number: RC0603FR-07332KL; Manufacturer: Yageo; Value: 332k; Supplier: mouser; Supplier Part Number: 603-RC0603FR-07332KL; Price: 0.1
R39 = 0.5 ohm ±1% 0.5W: Manufacturer Part Number: CSR1206FKR500; Manufacturer: SEI Stackpole; Supplier Part Number: 708-CSR1206FKR500; Supplier: mouser; Price: 0.3; Value: 0.5R
R40 = 180 ohm ±1% 0.1W: Manufacturer Part Number: RC0603FR-07180RL; Manufacturer: Yageo; Tolerance: +-1%; Temperature Coefficient: +-200ppm°C; Power (Watts): 0.1; Voltage (V): 75; Supplier Part Number: 603-RC0603FR-07180RL; Category: Resistor; Package / Case: 0603; Resistor (Ohms): 180R; Operating Temperature: -55°C to +155°C; Thickness (mm): 0.45; Supplier: mouser; Price: 0.1; Value: 180R
R41 R42 = RES: 0.1W/ 7.87kohm±1%; Manufacturer Part Number: RC0603FR-077K87L; Manufacturer: Yageo; Value: 7.87k; Supplier: mouser; Supplier Part Number: 603-RC0603FR-077K87L; Price: 0.1
R43 = 47 kohm ±1% 0.1W: Manufacturer Part Number: RC0603FR-0747KL; Manufacturer: Yageo; Tolerance: +-1%; Temperature Coefficient: +-200ppm°C; Power (Watts): 0.1; Voltage (V): 75; Supplier Part Number: 603-RC0603FR-0747KL; Category: Resistor; Package / Case: 0603; Resistor (Ohms): 47k; Operating Temperature: -55°C to +155°C; Thickness (mm): 0.45; Supplier: mouser; Price: 0.1; Value: 47k
R44 R45 = RES: 0.1W/ 51kohm±1%; Manufacturer Part Number: RC0603FR-0751KL; Manufacturer: Yageo; Value: 51k; Supplier: mouser; Supplier Part Number: 603-RC0603FR-0751KL; Price: 0.1
R46 = 6.98kohm ±1% 0.1W: Manufacturer Part Number: RC0603FR-076K98L; Manufacturer: Yageo; Supplier Part Number: 603-RC0603FR-076K98L; Price: 0.1; Supplier: mouser; Value: 6.98k
R47 = 3kohm ±1% 0.1W: Manufacturer Part Number: RC0603FR-073KL; Manufacturer: Yageo; Supplier Part Number: RC0603FR-073KL; Price: 0.1; Supplier: Mouser; Value: 3k
R48 = 2.2 kohm ±1% 0.1W: Manufacturer Part Number: RC0603FR-072K2L; Manufacturer: Yageo; Tolerance: +-1%; Temperature Coefficient: +-200ppm°C; Power (Watts): 0.1; Voltage (V): 75; Supplier Part Number: 603-RC0603FR-072K2L; Category: Resistor; Package / Case: 0603; Resistor (Ohms): 2.2k; Operating Temperature: -55°C to +155°C; Thickness (mm): 0.45; Supplier: mouser; Price: 0.1; Value: 2.2k
R49 R50 = RES: 0.1W/ 1kohm±1%; Manufacturer Part Number: RC0603FR-071KL; Manufacturer: Yageo; Value: 1k; Supplier: mouser; Supplier Part Number: 603-RC0603FR-071KL; Price: 0.1
TIM1 = PL-1-5-76X127-60: Thermal Interface Products ulTIMiFlux Gap Pad, 5.0 W/mK, 1mm Thickness, 76x127mm, Shore00: 60, Brown; Manufacturer: Wakefield-Vette; Value: PL-1-5-76X127-60; Manufacturer Part Number: PL-1-5-76X127-60; Price: 20; Supplier: Mouser; Supplier Part Number: 567-PL-1-5-76X127-60
U1 U2 = LM5060Q1MMX/NOPB: Hot Swap Voltage Controllers Automotive 5.5-V to 65-V high side protection controller 10-VSSOP -40 to 125; Manufacturer: Texas Instruments; Manufacturer Part Number: LM5060Q1MMX/NOPB; Value: LM5060Q1MMX/NOPB; Price: 2.8; Supplier: mouser; Supplier Part Number: 926-LM5060Q1MMX/NOPB
U3 = LM5108DRCT: Gate Drivers 2.6-A, 110-V half bridge gate driver with enable and interlock 10-VSON -40 to 125; Manufacturer: Texas Instruments; Manufacturer Part Number: LM5108DRCT; Value: LM5108DRCT; Price: 1.37; Supplier: mouser; Supplier Part Number: 595-LM5108DRCT
U4 U5 = INA240A2QDRQ1: Current Sense Amplifiers AEC-Q100, -4 to 80V, bi-directional, ultra-precise current sense amplifier w/ enhanced pwm rejection 8-SOIC -40 to 125; Manufacturer: Texas Instruments; Value: INA240A2QDRQ1; Manufacturer Part Number: INA240A2QDRQ1; Price: 3.76; Supplier: mouser; Supplier Part Number: 595-INA240A2QDRQ1
U6 U7 = LM5018MR/NOPB: 7.5-100V Wide Vin, 300mA Constant On-Time Synchronous Buck Regulator 8-SO PowerPAD -40 to 125; Manufacturer: Texas Instruments; Manufacturer Part Number: LM5018MR/NOPB; Value: LM5018MR/NOPB; SnapEDA_Link: https://www.snapeda.com/parts/LM5018MR/NOPB/Texas%20Instruments/view-part/436975/?ref=snap; Availability: Good; Texas_Instruments-Purchase-URL: https://snapeda.com/shop?store=Texas+Instruments&id=436975; Package: HSOIC-8 Texas Instruments; Mouser-Purchase-URL: https://snapeda.com/shop?store=Mouser&id=436975; Arrow_Asia-Purchase-URL: https://snapeda.com/shop?store=Arrow+Asia&id=436975; Price: 4; Supplier: Mouser; Supplier Part Number: LM5018MR/NOPB
U8 = MC33063AQDRQ1: Switching Voltage Regulators 1.5-A Peak Boost/ Buck/Inverting; Manufacturer: Texas Instruments; Manufacturer Part Number: MC33063AQDRQ1; Value: MC33063AQDRQ1; Price: 1.6; Supplier: mouser; Supplier Part Number: 595-MC33063AQDRQ1
U9 = REF3133AIDBZTG4: 3.3-V, 20-ppm/C max, 100-A, 3-pin SOT-23 series voltage reference 3-SOT-23 -40 to 125; Manufacturer: Texas Instruments; Package: SOT-23-3 Texas Instruments; Price: 2.8; Check_prices: https://www.snapeda.com/parts/REF3133AIDBZTG4/Texas+Instruments/view-part/?ref=eda; Value: REF3133AIDBZTG4; Supplier Part Number: 595-REF3133AIDBZTG4; Manufacturer Part Number: REF3133AIDBZTG4; Availability: In Stock; Supplier: Mouser

## Nets that join several sheets
+5V: DC-DC_Controller (C66.2 C67.2 U11.3), DC-DC_Converter (11 pins)
GND: DC-DC_Controller (21 pins), DC-DC_Converter (82 pins)